# EAGLE design switcher_wifi (EAGLE 7.6.0)
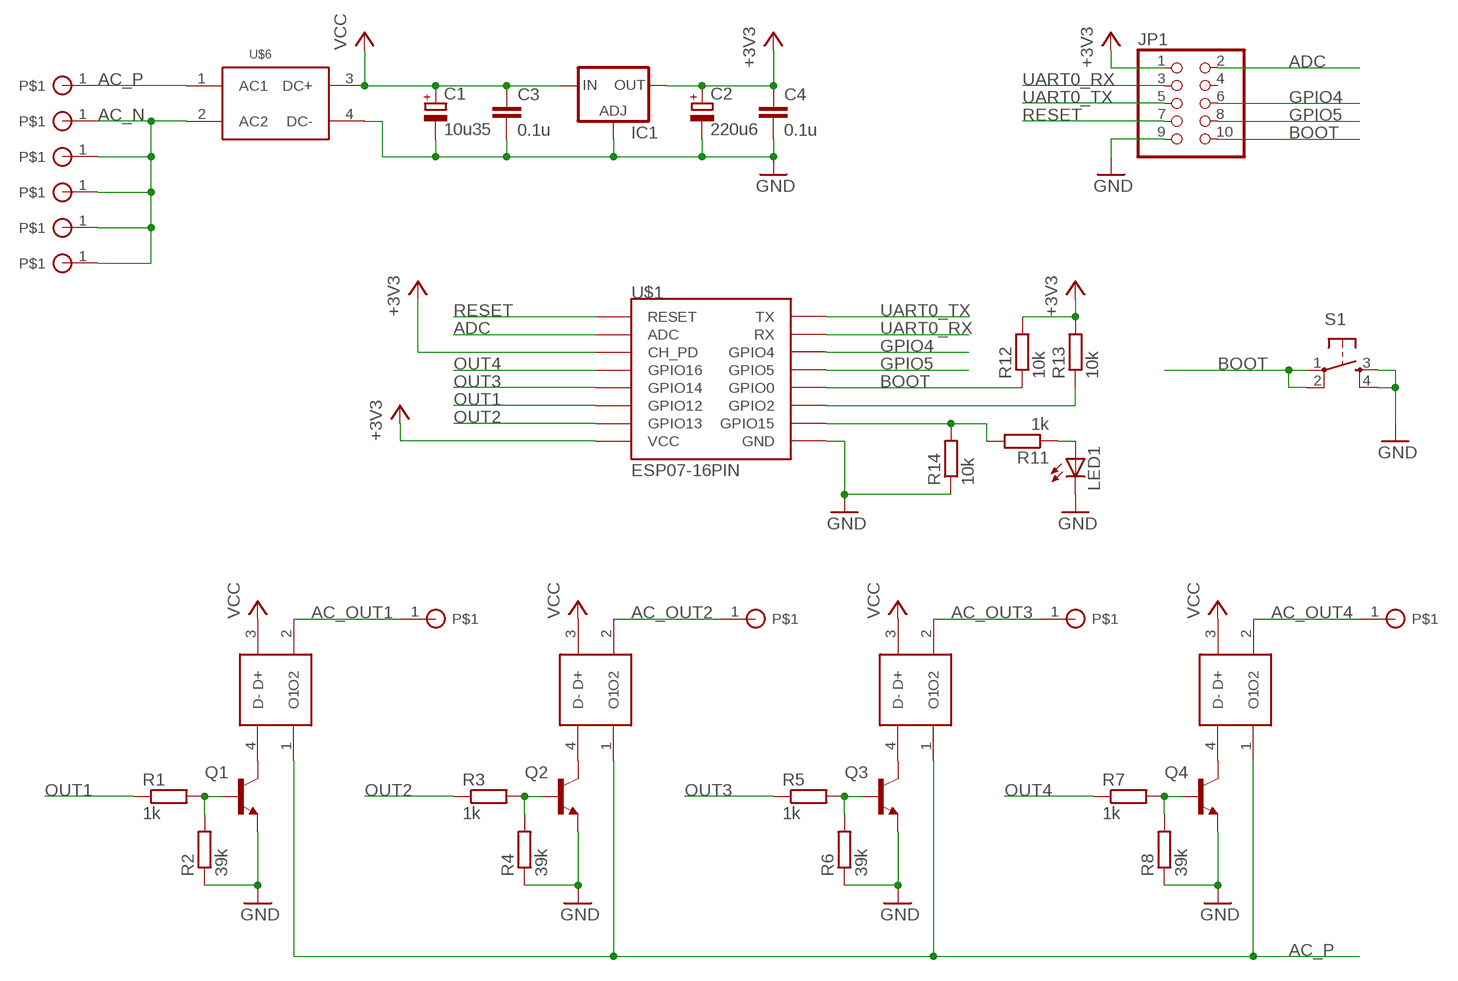
[diagram p0: schematic, sheet 1]

## Parts
C1  10u35  CPOL-EUSMCD  [SMC_D]
C2  220u6  CPOL-EUSMCD  [SMC_D]
C3  0.1u  C-EUC0805  [C0805]
C4  0.1u  C-EUC0805  [C0805]
IC1  LD117ADT33TR  [DPACK]
JP1  PINHD-2X5  [2X05]
LED1  LED3MM  [LED3MM]
Q1  BC817-16SMD  [SOT23-BEC]
Q2  BC817-16SMD  [SOT23-BEC]
Q3  BC817-16SMD  [SOT23-BEC]
Q4  BC817-16SMD  [SOT23-BEC]
R1  1k  R-EU_M0805  [M0805]
R2  39k  R-EU_M0805  [M0805]
R3  1k  R-EU_M0805  [M0805]
R4  39k  R-EU_M0805  [M0805]
R5  1k  R-EU_M0805  [M0805]
R6  39k  R-EU_M0805  [M0805]
R7  1k  R-EU_M0805  [M0805]
R8  39k  R-EU_M0805  [M0805]
R11  1k  R-EU_M0805  [M0805]
R12  10k  R-EU_M0805  [M0805]
R13  10k  R-EU_M0805  [M0805]
R14  10k  R-EU_M0805  [M0805]
S1  TAC_SWITCHPTH  [TACTILE-PTH]
U$1  ESP07-16PIN  [ESP07-16PIN]
U$2  G3MB-202P  [G3MB-202P]
U$3  G3MB-202P  [G3MB-202P]
U$4  G3MB-202P  [G3MB-202P]
U$5  G3MB-202P  [G3MB-202P]
U$6  AC-DC-5V-ALI1  [AC-DC-ALI1]
U$8  PWR_PIN  [PWR_PIN]
U$9  PWR_PIN  [PWR_PIN]
U$10  PWR_PIN  [PWR_PIN]
U$11  PWR_PIN  [PWR_PIN]
U$12  PWR_PIN  [PWR_PIN]
U$13  PWR_PIN  [PWR_PIN]
U$14  PWR_PIN  [PWR_PIN]
U$15  PWR_PIN  [PWR_PIN]
U$16  PWR_PIN  [PWR_PIN]
U$17  PWR_PIN  [PWR_PIN]

## Nets
+3V3: C2.+ C4.1 IC1.4(OUT) JP1.1 R12.2 R13.2 U$1.CH_PD U$1.VCC
AC_N: U$6.2(AC2) U$9.1 U$14.1 U$15.1 U$16.1 U$17.1
AC_OUT1: U$2.2(O2) U$10.1
AC_OUT2: U$3.2(O2) U$11.1
AC_OUT3: U$4.2(O2) U$12.1
AC_OUT4: U$5.2(O2) U$13.1
AC_P: U$2.1(O1) U$3.1(O1) U$4.1(O1) U$5.1(O1) U$6.1(AC1) U$8.1
ADC: JP1.2 U$1.ADC
BOOT: JP1.10 R12.1 S1.1 S1.2 U$1.GPIO0
GND: C1.- C2.- C3.2 C4.2 IC1.1(ADJ) JP1.9 LED1.K(C) Q1.E Q2.E Q3.E Q4.E R2.1 R4.1 R6.1 R8.1 R14.1 S1.3 S1.4 U$1.GND U$6.4(DC-)
GPIO4: JP1.6 U$1.GPIO4
GPIO5: JP1.8 U$1.GPIO5
N$1: Q1.C U$2.4(D-)
N$2: Q1.B R1.2 R2.2
N$3: Q2.C U$3.4(D-)
N$4: LED1.A R11.1
N$5: Q2.B R3.2 R4.2
N$6: Q3.C U$4.4(D-)
N$7: Q3.B R5.2 R6.2
N$8: Q4.C U$5.4(D-)
N$9: Q4.B R7.2 R8.2
N$12: R13.1 U$1.GPIO2
N$13: R11.2 R14.2 U$1.GPIO15
OUT1: R1.1 U$1.GPIO12
OUT2: R3.1 U$1.GPIO13
OUT3: R5.1 U$1.GPIO14
OUT4: R7.1 U$1.GPIO16
RESET: JP1.7 U$1.REST(RESET)
UART0_RX: JP1.3 U$1.RX
UART0_TX: JP1.5 U$1.TX
VCC: C1.+ C3.1 IC1.3(IN) U$2.3(D+) U$3.3(D+) U$4.3(D+) U$5.3(D+) U$6.3(DC+)
Unconnected: JP1.4

## Library data of the parts
C1 C2 = 0_levap_passive:CPOL-EU: POLARIZED CAPACITOR, European symbol
C3 C4 = 0_levap_passive:C-EU: CAPACITOR, European symbol
IC1 = 0_levap_chip:LD117A?*: Low drop fixed and adjustable positive voltage regulators 1 A Source: http://www.st.com/stonline/products/literature/ds/7194/ld1117axx.pdf
JP1 = 0_levap_connectors:PINHD-2X5: PIN HEADER
LED1 = 0_levap_active:LED: LED OSRAM: - CHIPLED LG R971, LG N971, LY N971, LG Q971, LY Q971, LO R971, LY R971 LH N974, LH R974 LS Q976, LO Q976, LY Q976 LO Q996 - Hyper CHIPLED LW Q18S LB Q993, LB Q99A, LB R99A - SideLED LS A670, LO A670, LY A670, LG A670, LP A670 LB A673, LV A673, LT A673, LW A673 LH A674 LY A675 LS A676, LA A676, LO A676, LY A676, LW A676 LS A679, LY A679, LG A679 - Hyper Micro SIDELED® LS Y876, LA Y876, LO Y876, LY Y876 LT Y87S - SmartLED LW L88C, LW L88S LB L89C, LB L89S, LG L890 LS L89K, LO L89K, LY L89K LS L896, LA L896, LO L896, LY L896 - TOPLED LS T670, LO T670, LY T670, LG T670, LP T670 LSG T670, LSP T670, LSY T670, LOP T670, LYG T670 LG T671, LOG T671, LSG T671 LB T673, LV T673, LT T673, LW T673 LH T674 LS T676, LA T676, LO T676, LY T676, LB T676, LH T676, LSB T676, LW T676 LB T67C, LV T67C, LT T67C, LS T67K, LO T67K, LY T67K, LW E67C LS E67B, LA E67B, LO E67B, LY E67B, LB E67C, LV E67C, LT E67C LW T67C LS T679, LY T679, LG T679 LS T770, LO T770, LY T770, LG T770, LP T770 LB T773, LV T773, LT T773, LW T773 LH T774 LS E675, LA E675, LY E675, LS T675 LS T776, LA T776, LO T776, LY T776, LB T776 LHGB T686 LT T68C, LB T68C - Hyper Mini TOPLED® LB M676 - Mini TOPLED Santana® LG M470 LS M47K, LO M47K, LY M47K Source: http://www.osram.convergy.de LUXEON: - LUMILED® LXK2-PW12-R00, LXK2-PW12-S00, LXK2-PW14-U00, LXK2-PW14-V00 LXK2-PM12-R00, LXK2-PM12-S00, LXK2-PM14-U00 LXK2-PE12-Q00, LXK2-PE12-R00, LXK2-PE12-S00, LXK2-PE14-T00, LXK2-PE14-U00 LXK2-PB12-K00, LXK2-PB12-L00, LXK2-PB12-M00, LXK2-PB14-N00, LXK2-PB14-P00, LXK2-PB14-Q00 LXK2-PR12-L00, LXK2-PR12-M00, LXK2-PR14-Q00, LXK2-PR14-R00 LXK2-PD12-Q00, LXK2-PD12-R00, LXK2-PD12-S00 LXK2-PH12-R00, LXK2-PH12-S00 LXK2-PL12-P00, LXK2-PL12-Q00, LXK2-PL12-R00 Source: www.luxeon.com KINGBRIGHT: KA-3528ASYC Source: www.kingbright.com
Q1-Q4 = 0_levap_active:BC817*: NPN Transistor
R1-R8 R11-R14 = 0_levap_passive:R-EU_: RESISTOR, European symbol
S1 = 0_levap_connectors:TAC_SWITCH: Momentary Switch Button commonly used for reset or general input. Spark Fun Electronics SKU : COM-00097
U$1 = esp8266modules:ESP07-16PIN: ESP8266 Wifi module 07 - 16 pins; DIMENSIONS: 22.0 x 16.0 mm; PINS: 16; PITCH: 0.078" / 2 mm
U$2-U$5 = 0_levap_active:G3MB-202P
U$6 = 0_levap_active:AC-DC-5V-ALI1
U$8-U$17 = 0_levap_power:PWR_PIN

## Board
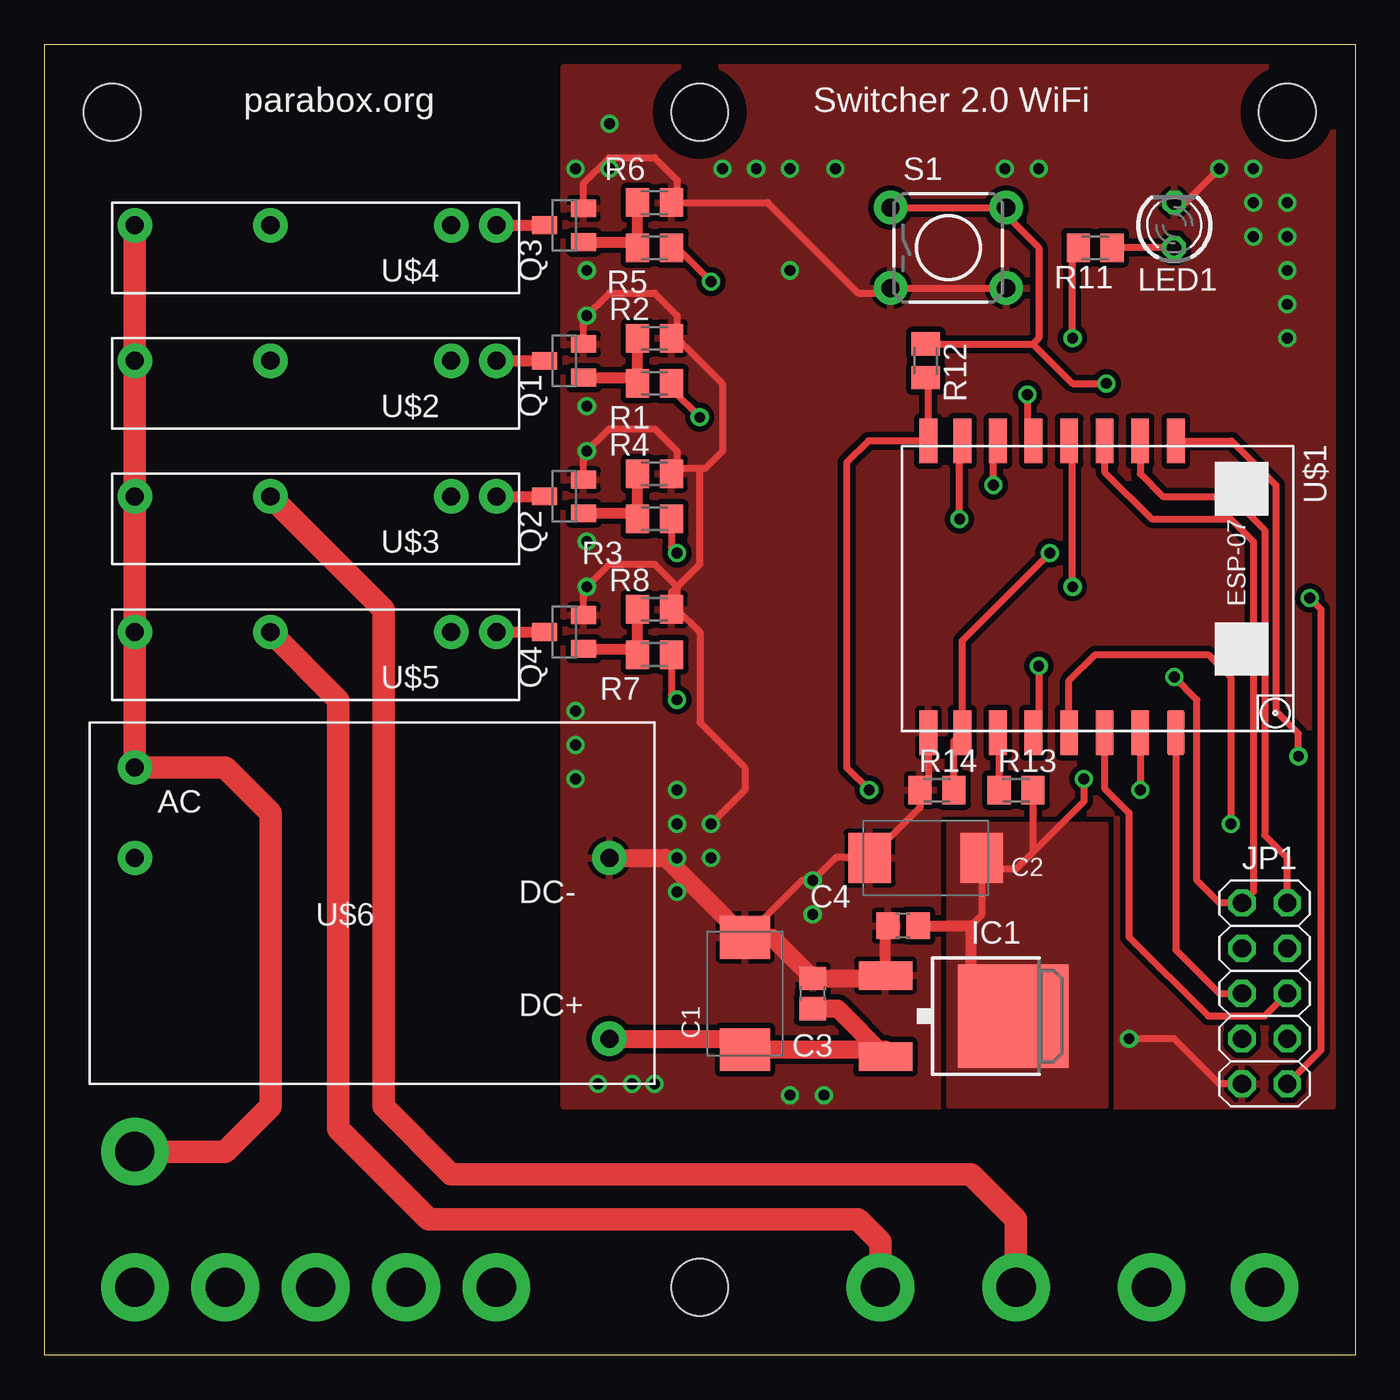
[diagram p1: board, top side]
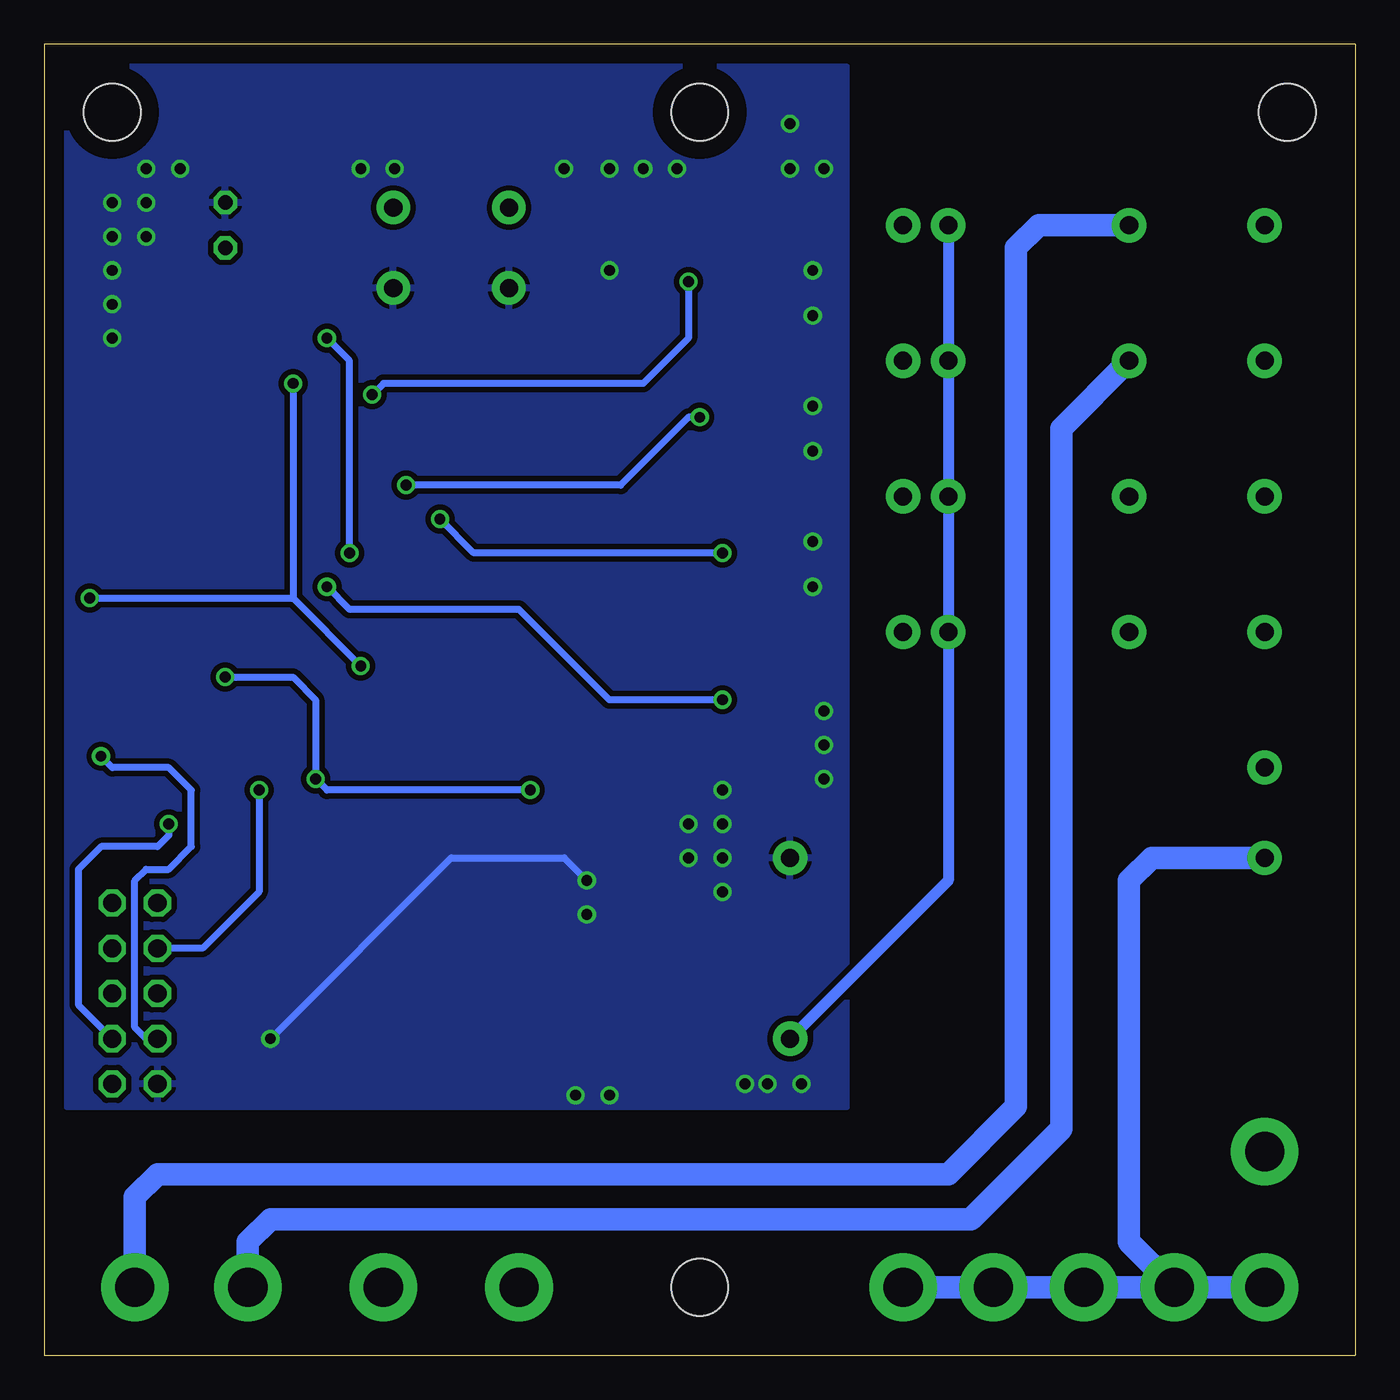
[diagram p2: board, bottom side, seen from below]

Size 73.66 x 73.66 mm. Coordinates in mm from the lower left corner, seen from the top.
Outline: 0,73.66 0,0 73.66,0 73.66,73.66 0,73.66
Copper layers (1*16): Top 0.035mm / dielectric 1.5mm / Bottom 0.035mm
Design rules "default *": minimum track width 10mil, minimum drill 0.3mm, track to track 8mil, track to pad 8mil, pad to pad 8mil, via to via 8mil, smd to smd 8mil, copper to edge 40mil, drill to drill 8mil, minimum pad ring 10mil, minimum via ring 8mil, stop-mask expansion 0.4mm, vias tented up to drill 0mil, thermal gap 10mil
Holes 3.2 mm at 36.83,3.81 36.83,69.85 3.81,69.85 69.85,69.85

### Footprints (pad centres in the part's own frame; a part is rotated, then mirrored left to right if it is on the bottom)
SMC_D = smd 2.4 x 2.8: + -3.15,0; - 3.15,0
C0805 = smd 1.3 x 1.5: 1 -0.85,0; 2 0.85,0
DPACK = smd 1.6 x 3: 1 -2.28,-4.8; 3 2.28,-4.8 | smd 5.8 x 6.2: 4 0,2.38
2X05 = drill 1.016 octagon: 1 -5.08,-1.27; 2 -5.08,1.27; 3 -2.54,-1.27; 4 -2.54,1.27; 5 0,-1.27; 6 0,1.27; 7 2.54,-1.27; 8 2.54,1.27; 9 5.08,-1.27; 10 5.08,1.27
LED3MM = drill 0.813 octagon: A -1.27,0; K 1.27,0
SOT23-BEC = smd 1 x 1.4: B -0.95,-1.1; C 0,1.1; E 0.95,-1.1
M0805 = smd 1.3 x 1.6: 1 -0.95,0; 2 0.95,0
TACTILE-PTH = drill 1.016 pad 1.88: 1 -3.251,2.261; 2 3.251,2.261; 3 -3.251,-2.261; 4 3.251,-2.261
ESP07-16PIN = smd 2.5 x 1: ADC -8.2,3.8; CH_PD -8.2,1.8; GND 8.2,-8.105; GPIO0 8.2,-2.2; GPIO2 8.2,-4.2; GPIO4 8.2,1.8; GPIO5 8.2,-0.2; GPIO12 -8.2,-4.2; GPIO13 -8.2,-6.2; GPIO14 -8.2,-2.2; GPIO15 8.2,-6.2; GPIO16 -8.2,-0.2; REST -8.2,5.8; RX 8.2,3.8; TX 8.2,5.8; VCC -8.2,-8.105
G3MB-202P = drill 1.016 pad 1.93: 1 10.16,0; 2 2.54,0; 3 -7.62,0; 4 -10.16,0
AC-DC-ALI1 = drill 1.016 pad 1.93: 1 0,0; 2 0,-5.08; 3 26.67,-15.24; 4 26.67,-5.08
PWR_PIN = drill 2.2 pad 3.81: 1 0,0

### Placement (x,y rotation side)
C1  39.37,20.32 90 top
C2  49.53,27.94 180 top
C3  43.18,20.32 90 top
C4  48.26,24.13 180 top
IC1  52.07,19.05 270 top
JP1  68.58,20.32 270 top
LED1  63.5,63.5 90 top
Q1  29.21,55.88 90 top
Q2  29.21,48.26 90 top
Q3  29.21,63.5 90 top
Q4  29.21,40.64 90 top
R1  34.29,54.61 180 top
R2  34.29,57.15 180 top
R3  34.29,46.99 180 top
R4  34.29,49.53 180 top
R5  34.29,62.23 180 top
R6  34.29,64.77 180 top
R7  34.29,39.37 180 top
R8  34.29,41.91 180 top
R11  59.06,62.23 180 top
R12  49.53,55.88 270 top
R13  54.61,31.75 0 top
R14  50.16,31.75 0 top
S1  50.8,62.23 0 top
U$1  57.79,43.18 270 top
U$2  15.24,55.88 180 top
U$3  15.24,48.26 180 top
U$4  15.24,63.5 180 top
U$5  15.24,40.64 180 top
U$6  5.08,33.02 0 top
U$8  5.08,11.43 270 top
U$9  25.4,3.81 0 top
U$10  62.23,3.81 0 top
U$11  54.61,3.81 0 top
U$12  68.58,3.81 0 top
U$13  46.99,3.81 0 top
U$14  5.08,3.81 0 top
U$15  10.16,3.81 0 top
U$16  15.24,3.81 0 top
U$17  20.32,3.81 0 top

### Tracks (layer width: path | path; a pad name or v marks a point on that pad's centre or on a via)
+3V3  (via drill 0.61)
  Top 0.406: C2.+ 52.68,27.3 | 52.68,27.3 52.68,24.74 52.07,24.13 | R13.2 55.56,28.25 | 55.56,28.25 54.61,27.3 52.68,27.3 | R12.2 49.68,54.78 U$1.VCC 46.3,51.38 45.09,50.16 45.09,33.02 v46.36,31.75 | v58.42,32.38 58.42,31.11 55.56,28.25 | v63.5,38.1 64.77,36.83 64.77,26.67 66.04,25.4 JP1.1 67.95,26.04 67.95,45.72 66.67,46.99 62.23,46.99 59.59,49.63 U$1.CH_PD
  Top 0.61: C4.1 52.07,24.13 52.07,21.43 IC1.4
  Bottom 0.406: v46.36,31.75 57.79,31.75 v58.42,32.38 58.42,36.83 59.69,38.1 v63.5,38.1
  pour Top (isolate 0.305, no thermals): 50.8,29.84 59.69,29.84 59.69,13.97 50.8,13.97
AC_N
  Bottom 1.27: U$6.2 11.43,27.94 12.7,26.67 12.7,6.35 U$15.1 | U$15.1 U$14.1 | U$9.1 U$17.1 U$16.1 U$15.1
AC_OUT1
  Bottom 1.27: U$10.1 62.23,6.35 60.96,7.62 21.59,7.62 16.51,12.7 16.51,52.07 U$2.2
AC_OUT2
  Top 1.27: U$11.1 54.61,7.62 52.07,10.16 22.86,10.16 19.05,13.97 19.05,41.91 U$3.2
AC_OUT3
  Bottom 1.27: U$12.1 68.58,8.89 67.31,10.16 22.86,10.16 19.05,13.97 19.05,62.23 17.78,63.5 U$4.2
AC_OUT4
  Top 1.27: U$13.1 46.99,6.35 45.72,7.62 21.59,7.62 16.51,12.7 16.51,36.83 U$5.2
AC_P
  Top 1.27: U$4.1 U$2.1 U$3.1 U$5.1 U$6.1 10.16,33.02 12.7,30.48 12.7,13.97 10.16,11.43 U$8.1
ADC
  Top 0.406: U$1.ADC 61.59,49.54 62.86,48.26 66.67,48.26 68.58,46.35 68.58,29.21 69.85,27.94 JP1.2
BOOT  (via drill 0.61)
  Top 0.406: R12.1 55.57,56.83 | 55.57,56.83 57.79,54.61 v59.69,54.61 | v55.88,38.73 55.88,35.27 U$1.GPIO0 | JP1.10 71.75,17.14 71.75,41.91 v71.12,42.55 | 55.57,56.83 55.88,57.15 55.88,62.23 54.05,64.06 S1.2 S1.1
  Bottom 0.406: v59.69,54.61 59.69,42.55 | 59.69,42.55 v55.88,38.73 | v71.12,42.55 59.69,42.55
GND  (via drill 0.61)
  Top 0.406: JP1.9 66.04,15.24 63.5,17.78 v60.96,17.78 | C1.- 42.57,26.67 v43.18,26.67 44.48,27.96 46.36,27.96 C2.- 49.22,30.77 R14.1 49.68,32.22 U$1.GND | Q4.E 30.31,43.01 31.75,44.45 34.29,44.45 35.56,43.18 35.56,42.23 R8.1 | Q2.E 30.31,50.63 31.75,52.07 34.29,52.07 35.56,50.8 35.56,49.85 | 35.56,49.85 R4.1 | Q1.E 30.31,58.25 31.75,59.69 34.29,59.69 35.56,58.42 35.56,57.47 R2.1 35.56,57.15 38.1,54.61 38.1,50.8 37.15,49.85 36.83,49.85 | Q3.E 30.31,65.87 31.75,67.31 34.29,67.31 35.56,66.04 35.56,65.09 R6.1 40.64,64.77 45.72,59.69 47.27,59.69 S1.3 S1.4 | 35.56,49.85 36.83,49.85 | R8.1 35.24,42.86 36.83,44.45 36.83,49.85 | R8.1 35.56,41.91 36.83,40.64 36.83,35.56 39.37,33.02 39.37,31.75 v37.47,29.84 | LED1.K 64.14,64.77 v66.04,66.67
  Top 0.61: IC1.1 47.27,23.99 C4.2
  Top 1.016: IC1.1 47.11,21.17 C3.2 40.88,23.47 C1.- 34.9,27.94 U$6.4
  Bottom 0.406: v60.96,17.78 50.8,27.94 44.45,27.94 v43.18,26.67
  other vias: 31.75,69.22 29.84,66.67 31.75,66.67 38.1,66.67 40.01,66.67 41.91,66.67 44.45,66.67 53.98,66.67 55.88,66.67 67.95,66.67 69.85,57.15 67.95,64.77 69.85,64.77 67.95,62.87 69.85,62.87 69.85,60.96 69.85,59.05 30.48,58.42 30.48,60.96 30.48,50.8 30.48,53.34 30.48,43.18 30.48,45.72 41.91,60.96 29.84,36.2 29.84,34.29 29.84,32.38 35.56,31.75 35.56,29.84 37.47,27.94 35.56,27.94 35.56,26.04 43.18,24.77 31.12,15.24 33.02,15.24 34.29,15.24 41.91,14.61 43.82,14.61
  pour Bottom (isolate 0.305): 28.58,72.39 72.39,72.39 72.39,13.97 28.58,13.97
  pour Top (isolate 0.305, rank 2): 29.21,72.39 72.39,72.39 72.39,13.97 29.21,13.97
GPIO4
  Top 0.406: U$1.GPIO4 59.59,31.86 60.96,30.48 60.96,23.5 65.41,19.05 68.58,19.05 JP1.6
GPIO5  (via drill 0.61)
  Top 0.406: U$1.GPIO5 57.59,37.9 59.06,39.37 65.41,39.37 66.67,38.1 v66.67,29.84
  Bottom 0.406: v66.67,29.84 66.67,29.21 67.31,28.57 70.48,28.57 71.75,27.3 71.75,19.68 JP1.8
N$1
  Top 0.61: U$2.4 Q1.C
N$2
  Top 0.61: Q1.B 33.02,54.93 R1.2 R2.2
N$3
  Top 0.61: U$3.4 Q2.C
N$4
  Top 0.406: LED1.A R11.1
N$5
  Top 0.61: Q2.B 33.02,47.31 R3.2 R4.2
N$6
  Top 0.61: U$4.4 Q3.C
N$7
  Top 0.61: Q3.B 33.02,62.55 R5.2 R6.2
N$8
  Top 0.61: U$5.4 Q4.C
N$9
  Top 0.61: Q4.B 33.02,39.69 R7.2 R8.2
N$12
  Top 0.406: R13.1 53.66,34.91 U$1.GPIO2
N$13  (via drill 0.61)
  Top 0.406: R14.2 51.12,34.51 U$1.GPIO15 51.59,40.16 v56.52,45.09 | v57.79,57.15 57.79,61.91 R11.2
  Bottom 0.406: v56.52,45.09 56.52,55.88 v57.79,57.15
OUT1  (via drill 0.61)
  Top 0.406: R1.1 35.24,54.3 v36.83,52.7 | v53.34,48.9 53.34,51.13 U$1.GPIO12
  Bottom 0.406: v36.83,52.7 37.47,52.7 41.27,48.9 v53.34,48.9
OUT2  (via drill 0.61)
  Top 0.406: R3.1 35.24,45.41 v35.56,45.09 | v51.44,46.99 51.44,51.23 U$1.GPIO13
  Bottom 0.406: v35.56,45.09 49.53,45.09 v51.44,46.99
OUT3  (via drill 0.61)
  Top 0.406: R5.1 35.56,62.23 v37.47,60.33 | v55.25,53.98 55.25,51.72 U$1.GPIO14
  Bottom 0.406: v37.47,60.33 37.47,57.15 40.01,54.61 54.61,54.61 v55.25,53.98
OUT4  (via drill 0.61)
  Top 0.406: R7.1 35.24,37.15 v35.56,36.83 | v57.79,43.18 57.79,51.18 U$1.GPIO16
  Bottom 0.406: v35.56,36.83 41.91,36.83 46.99,41.91 56.52,41.91 v57.79,43.18
RESET  (via drill 0.61)
  Top 0.406: U$1.REST 66.73,51.38 69.22,48.9 69.22,36.2 70.48,34.92 v70.48,33.66
  Bottom 0.406: JP1.7 67.95,17.78 68.58,18.41 68.58,26.67 67.95,27.3 66.67,27.3 65.41,28.57 65.41,31.75 66.67,33.02 69.85,33.02 v70.48,33.66
UART0_RX  (via drill 0.61)
  Top 0.406: U$1.RX v61.59,31.76 v61.59,31.75
  Bottom 0.406: v61.59,31.75 61.59,26.04 64.77,22.86 JP1.3
UART0_TX
  Top 0.406: U$1.TX 63.59,22.77 66.04,20.32 JP1.5
VCC
  Top 1.016: U$6.3 39.37,17.78 C1.+ 47.27,17.17 IC1.3 44.57,19.47 C3.1
  Bottom 0.61: U$4.3 U$2.3 U$3.3 U$5.3 22.86,26.67 U$6.3

### Text on the board
tPlace: parabox.org | Switcher 2.0 WiFi